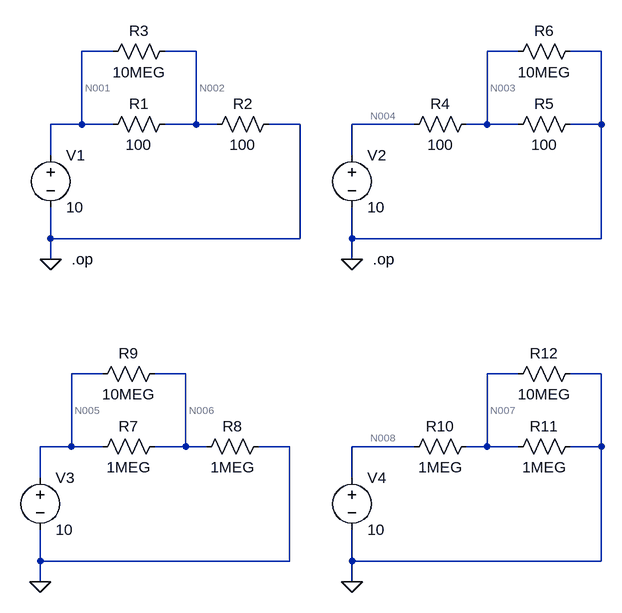
[diagram p0: schematic R_voltmeter=10M.asc]
R_voltmeter=10M.asc, the LTspice schematic file:
Version 4
SHEET 1 880 680
WIRE -368 -512 -416 -512
WIRE -240 -512 -288 -512
WIRE 256 -512 208 -512
WIRE 384 -512 336 -512
WIRE -416 -400 -416 -512
WIRE -416 -400 -464 -400
WIRE -368 -400 -416 -400
WIRE -240 -400 -240 -512
WIRE -240 -400 -288 -400
WIRE -208 -400 -240 -400
WIRE -80 -400 -128 -400
WIRE 96 -400 0 -400
WIRE 208 -400 208 -512
WIRE 208 -400 176 -400
WIRE 256 -400 208 -400
WIRE 384 -400 384 -512
WIRE 384 -400 336 -400
WIRE -464 -352 -464 -400
WIRE 0 -352 0 -400
WIRE -464 -224 -464 -272
WIRE -80 -224 -80 -400
WIRE -80 -224 -464 -224
WIRE 0 -224 0 -272
WIRE 384 -224 384 -400
WIRE 384 -224 0 -224
WIRE -464 -192 -464 -224
WIRE 0 -192 0 -224
WIRE -384 -16 -432 -16
WIRE -256 -16 -304 -16
WIRE 256 -16 208 -16
WIRE 384 -16 336 -16
WIRE -432 96 -432 -16
WIRE -432 96 -480 96
WIRE -384 96 -432 96
WIRE -256 96 -256 -16
WIRE -256 96 -304 96
WIRE -224 96 -256 96
WIRE -96 96 -144 96
WIRE 96 96 0 96
WIRE 208 96 208 -16
WIRE 208 96 176 96
WIRE 256 96 208 96
WIRE 384 96 384 -16
WIRE 384 96 336 96
WIRE -480 144 -480 96
WIRE 0 144 0 96
WIRE -480 272 -480 224
WIRE -96 272 -96 96
WIRE -96 272 -480 272
WIRE 0 272 0 224
WIRE 384 272 384 96
WIRE 384 272 0 272
WIRE -480 304 -480 272
WIRE 0 304 0 272
FLAG -464 -192 0
FLAG 0 -192 0
FLAG -480 304 0
FLAG 0 304 0
DATAFLAG -416 -512 ""
DATAFLAG -240 -512 ""
DATAFLAG 208 -512 ""
DATAFLAG 384 -512 ""
DATAFLAG -432 -16 ""
DATAFLAG -256 -16 ""
DATAFLAG 208 -16 ""
DATAFLAG 384 -16 ""
SYMBOL voltage -464 -368 R0
WINDOW 123 0 0 Left 2
WINDOW 39 0 0 Left 2
SYMATTR InstName V1
SYMATTR Value 10
SYMBOL res -384 -384 R270
WINDOW 0 32 56 VTop 2
WINDOW 3 0 56 VBottom 2
SYMATTR InstName R1
SYMATTR Value 100
SYMBOL res -224 -384 R270
WINDOW 0 32 56 VTop 2
WINDOW 3 0 56 VBottom 2
SYMATTR InstName R2
SYMATTR Value 100
SYMBOL res -384 -496 R270
WINDOW 0 32 56 VTop 2
WINDOW 3 0 56 VBottom 2
SYMATTR InstName R3
SYMATTR Value 10MEG
SYMBOL voltage 0 -368 R0
WINDOW 123 0 0 Left 2
WINDOW 39 0 0 Left 2
SYMATTR InstName V2
SYMATTR Value 10
SYMBOL res 80 -384 R270
WINDOW 0 32 56 VTop 2
WINDOW 3 0 56 VBottom 2
SYMATTR InstName R4
SYMATTR Value 100
SYMBOL res 240 -384 R270
WINDOW 0 32 56 VTop 2
WINDOW 3 0 56 VBottom 2
SYMATTR InstName R5
SYMATTR Value 100
SYMBOL res 240 -496 R270
WINDOW 0 32 56 VTop 2
WINDOW 3 0 56 VBottom 2
SYMATTR InstName R6
SYMATTR Value 10MEG
SYMBOL voltage -480 128 R0
WINDOW 123 0 0 Left 2
WINDOW 39 0 0 Left 2
SYMATTR InstName V3
SYMATTR Value 10
SYMBOL res -400 112 R270
WINDOW 0 32 56 VTop 2
WINDOW 3 0 56 VBottom 2
SYMATTR InstName R7
SYMATTR Value 1MEG
SYMBOL res -240 112 R270
WINDOW 0 32 56 VTop 2
WINDOW 3 0 56 VBottom 2
SYMATTR InstName R8
SYMATTR Value 1MEG
SYMBOL res -400 0 R270
WINDOW 0 32 56 VTop 2
WINDOW 3 0 56 VBottom 2
SYMATTR InstName R9
SYMATTR Value 10MEG
SYMBOL voltage 0 128 R0
WINDOW 123 0 0 Left 2
WINDOW 39 0 0 Left 2
SYMATTR InstName V4
SYMATTR Value 10
SYMBOL res 80 112 R270
WINDOW 0 32 56 VTop 2
WINDOW 3 0 56 VBottom 2
SYMATTR InstName R10
SYMATTR Value 1MEG
SYMBOL res 240 112 R270
WINDOW 0 32 56 VTop 2
WINDOW 3 0 56 VBottom 2
SYMATTR InstName R11
SYMATTR Value 1MEG
SYMBOL res 240 0 R270
WINDOW 0 32 56 VTop 2
WINDOW 3 0 56 VBottom 2
SYMATTR InstName R12
SYMATTR Value 10MEG
TEXT -432 -192 Left 2 !.op
TEXT 32 -192 Left 2 !.op

The netlist it stands for:
* R_voltmeter=10M.asc
V1 N001 0 10
R1 N001 N002 100
R2 N002 0 100
R3 N001 N002 10MEG
V2 N004 0 10
R4 N004 N003 100
R5 N003 0 100
R6 N003 0 10MEG
V3 N005 0 10
R7 N005 N006 1MEG
R8 N006 0 1MEG
R9 N005 N006 10MEG
V4 N008 0 10
R10 N008 N007 1MEG
R11 N007 0 1MEG
R12 N007 0 10MEG
.op
.op
.backanno
.end

* Results of the author's LTspice run, read from the files saved beside the schematic
* Operating Point:
*   V(n001) = 10 V
*   V(n002) = 5 V
*   V(n004) = 10 V
*   V(n003) = 5 V
*   V(n005) = 10 V
*   V(n006) = 5.238 V
*   V(n008) = 10 V
*   V(n007) = 4.762 V
*   I(R12) = 476.2 nA
*   I(R11) = 4.762 µA
*   I(R10) = 5.238 µA
*   I(R9) = 476.2 nA
*   I(R8) = 5.238 µA
*   I(R7) = 4.762 µA
*   I(R6) = 500 nA
*   I(R5) = 50 mA
*   I(R4) = 50 mA
*   I(R3) = 500 nA
*   I(R2) = 50 mA
*   I(R1) = 50 mA
*   I(V4) = -5.238 µA
*   I(V3) = -5.238 µA
*   I(V2) = -50 mA
*   I(V1) = -50 mA